# Altium schematic sheet 06_SDIO.SchDoc
size A4
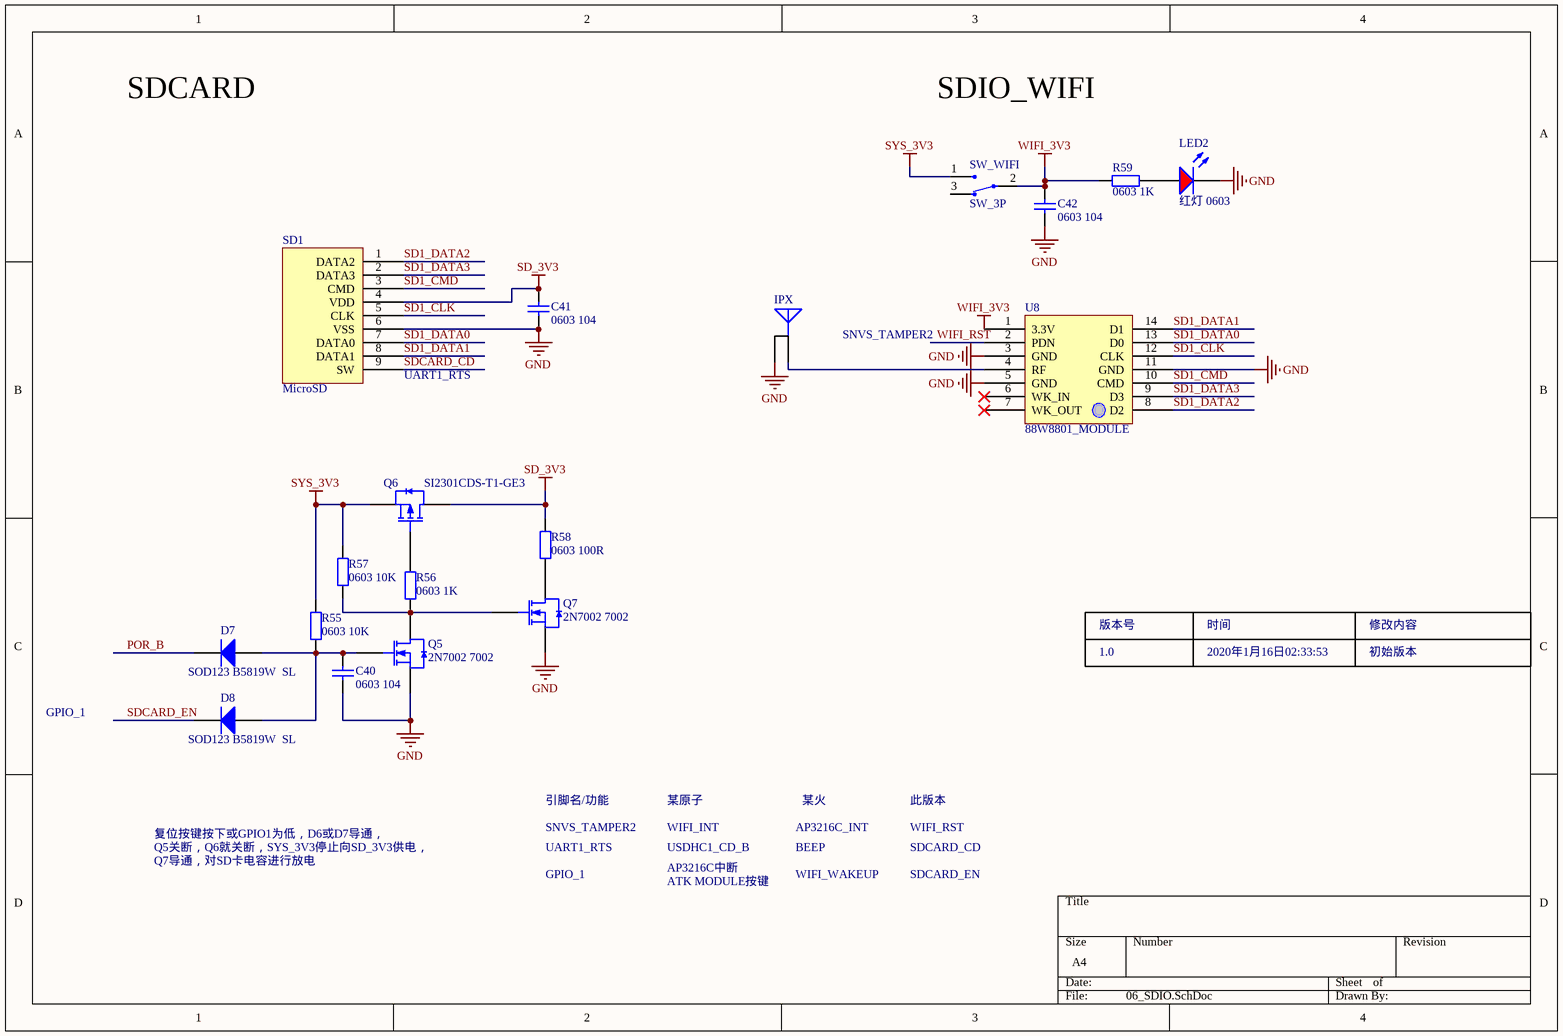
[diagram p0: 06_SDIO.SchDoc]

## Parts
C40  0603 104  [LC-0603_C]
C41  0603 104  [LC-0603_C]
C42  0603 104  [LC-0603_C]
D7  SOD123 B5819W  SL  [LC-SOD-123]
D8  SOD123 B5819W  SL  [LC-SOD-123]
IPX  (no value)  [IPX]
LED2  红灯 0603  [LC-0603_LED_S1]
Q5  2N7002 7002  [LC-SOT-23(SOT-23-3)]
Q6  SI2301CDS-T1-GE3  [LC-SOT-23(SOT-23-3)]
Q7  2N7002 7002  [LC-SOT-23(SOT-23-3)]
R55  0603 10K  [LC-0603_R]
R56  0603 1K  [LC-0603_R]
R57  0603 10K  [LC-0603_R]
R58  0603 100R  [LC-0603_R]
R59  0603 1K  [LC-0603_R]
SD1  MicroSD  [MICROSD_PUSH]
SW_WIFI  SW_3P  [SW_3P]
U8  88W8801_MODULE  [88W8801_MODULE]

## Nets
GND: C40.2 C41.2 C42.2 IPX.2(GND) LED2.K Q5.2(S) Q7.2(S) SD1.6(VSS) U8.3(GND) U8.5(GND) U8.11(GND)
SD_3V3: C41.1 Q6.3(D) R58.1 SD1.4(VDD)
SYS_3V3: Q6.2(S) R55.1 R57.1 SW_WIFI.1
WIFI_3V3: C42.1 R59.1 SW_WIFI.2 U8.1(3.3V)
POR_B: D7.2(K)
SD1_CLK: SD1.5(CLK) U8.12(CLK)
SD1_CMD: SD1.3(CMD) U8.10(CMD)
SD1_DATA0: SD1.7(DATA0) U8.13(D0)
SD1_DATA1: SD1.8(DATA1) U8.14(D1)
SD1_DATA2: SD1.1(DATA2) U8.8(D2)
SD1_DATA3: SD1.2(DATA3) U8.9(D3)
SDCARD_CD: SD1.9(SW)
SDCARD_EN: D8.2(K)
WIFI_RST: U8.2(PDN)
NetC40_1: C40.1 D7.1(A) D8.1(A) Q5.1(G) R55.2
NetIPX_1: IPX.1(RF) U8.4(RF)
NetLED2_A: LED2.A R59.2
NetQ5_3: Q5.3(D) Q7.1(G) R56.2 R57.2
NetQ6_1: Q6.1(G) R56.1
NetQ7_3: Q7.3(D) R58.2

Not connected (* = marked no-connect by the designer): SW_WIFI 3; U8 6(WK_IN)* 7(WK_OUT)*

## Notes on the sheet
- SDCARD
- SDIO_WIFI
- (near SD1) UART1_RTS
- SNVS_TAMPER2
- 版本号
- 1.0
- 2020年1月16日02:33:53
- 时间
- 修改内容
- 初始版本
- GPIO_1
- 复位按键按下或GPIO1为低，D6或D7导通，
- Q5关断，Q6就关断，SYS_3V3停止向SD_3V3供电，
- 引脚名/功能
- UART1_RTS
- WIFI_INT
- 某原子
- USDHC1_CD_B
- AP3216C_INT
- BEEP
- 某火
- 此版本
- WIFI_RST
- SDCARD_CD
- Q7导通，对SD卡电容进行放电
- AP3216C中断
- ATK MODULE按键
- WIFI_WAKEUP
- SDCARD_EN

## Library data of the parts
C40-C42 = 0603 1.5nF (152) 10% 50V: 贴片电容; ComponentLink1Description: 供应商链接; ComponentLink1URL: http://www.szlcsc.com/product/details_1947.html; Package: 0603; Supplier: LC; SuppliersPartNumber: C1595
D7 D8 = SOD-123 B5819W  SL: 肖特基二极管; ComponentLink1Description: 供应商链接; ComponentLink1URL: http://www.szlcsc.com/product/details_9093.html; Package: SOD-123; Supplier: LC; SuppliersPartNumber: C8598
IPX = RF_ANT
LED2 = 0603 红灯: 发光二极管; ComponentLink1Description: 供应商链接; ComponentLink1URL: http://www.szlcsc.com/product/details_2659.html; Package: 0603; Supplier: LC; SuppliersPartNumber: C2286
Q5 Q7 = 2N7002 7002: MOS(场效应管); ComponentLink1Description: 供应商链接; ComponentLink1URL: http://www.szlcsc.com/product/details_9040.html; Package: SOT-23(SOT-23-3); Supplier: LC; SuppliersPartNumber: C8545
Q6 = SI2301CDS-T1-GE3: MOS(场效应管); ComponentLink1Description: 供应商链接; ComponentLink1URL: http://www.szlcsc.com/product/details_11030.html; Package: SOT-23(SOT-23-3); Supplier: LC; SuppliersPartNumber: C10487
R55-R59 = 0603 1.1KΩ (1101) 1%: 贴片电阻; ComponentLink1Description: 供应商链接; ComponentLink1URL: http://www.szlcsc.com/product/details_23491.html; Package: 0603; Supplier: LC; SuppliersPartNumber: C22764